# Altium project Bluethooth-V1.PrjPcb
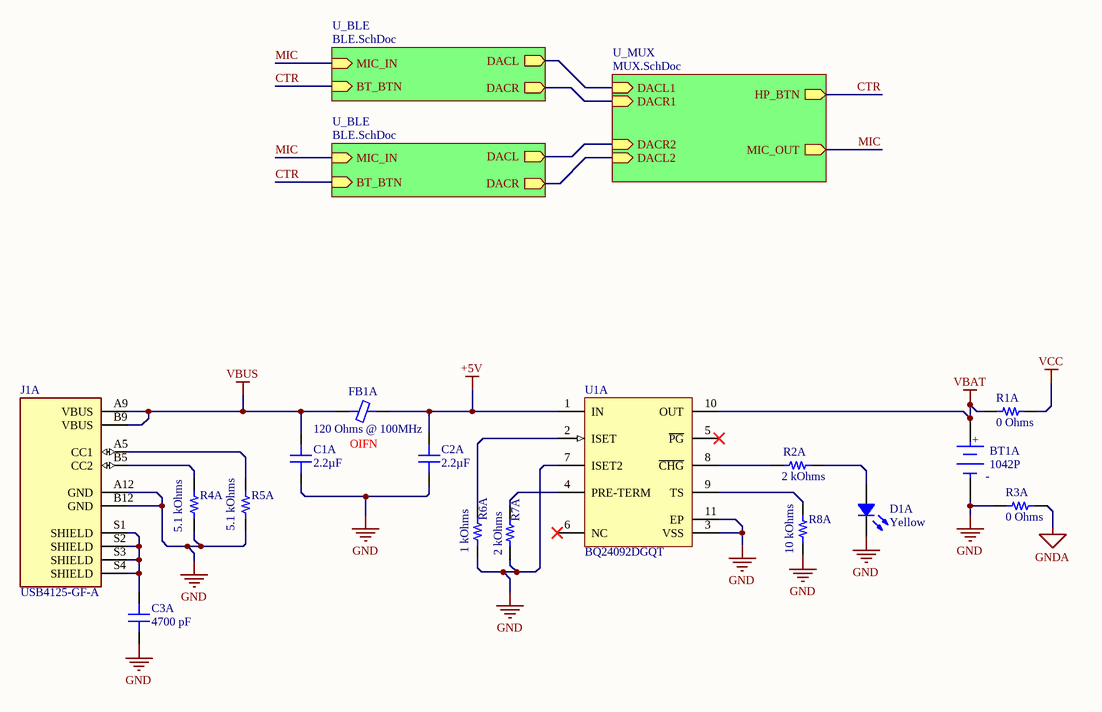
[diagram p0: Power.SchDoc]
CAGE_CODE: #; Date: 08.01.2023; DOC_NO_ASSY_DWG: #0112023010830; DOC_NO_BOM: #0112023010840; DOC_NO_FAB_DWG: #0112023010820; DOC_NO_SCH_DWG: #0112023010800; DocumentRevision: V2.0; PCB_DWG_NO: #0112023010810; Project: BLE-MUX; ProjectRevision: V1.1; Revision: V1.1
3 sheets, 58 parts. Net scope: hierarchical (ports join the sheet entries above them; power ports are global).
Board file: BLE.PcbDoc
Sheets:
  Power.SchDoc
    U_BLE = BLE.SchDoc
    U_MUX = MUX.SchDoc
    U_BLE = BLE.SchDoc

## Sheet Power.SchDoc: MAIN BLOCK & POWER
size A4; SheetNumber: 1; SheetTotal: 3

### Parts
BT1A  1042P  [FP-1042P-MFG]
C1A  2.2µF  [CAP 0402_1005]
C2A  2.2µF  [CAP 0402_1005]
C3A  4700 pF  [CAP 0402_1005]
D1A  Yellow  [LED 0402_1005 YELLOW]
FB1A  120 Ohms @ 100MHz  [FER 0201_0603]
J1A  USB4125-GF-A  [USB4125-GF-A]
R1A  0 Ohms  [RES 0603_1608]
R2A  2 kOhms  [RES 0402_1005]
R3A  0 Ohms  [RES 0603_1608]
R4A  5.1 kOhms  [RES 0402_1005]
R5A  5.1 kOhms  [RES 0402_1005]
R6A  1 kOhms  [RES 0402_1005]
R7A  2 kOhms  [RES 0402_1005]
R8A  10 kOhms  [RES 0402_1005]
U1A  BQ24092DGQT  [DGQ0010D_L]

### Sub-sheets
U_BLE = BLE.SchDoc: DACR (out), DACL (out), MIC_IN (in), BT_BTN (in)
U_BLE = BLE.SchDoc: DACR (out), DACL (out), MIC_IN (in), BT_BTN (in)
U_MUX = MUX.SchDoc: DACL1 (in), DACL2 (in), DACR1 (in), DACR2 (in), HP_BTN (out), MIC_OUT (out)

### Nets
+5V: C2A.2 FB1A.2 U1A.1(IN)
GND: BT1A.1(C) C1A.1 C2A.1 C3A.1 D1A.2 J1A.A12(GND) J1A.B12(GND) R3A.1 R4A.1 R5A.1 R6A.1 R7A.1 R8A.1 U1A.3(VSS) U1A.7(ISET2) U1A.11(EP)
GNDA: R3A.2
VBAT: BT1A.2(A) R1A.1 U1A.10(OUT)
VBUS: C1A.2 FB1A.1 J1A.A9(VBUS) J1A.B9(VBUS)
VCC: R1A.2
CTR: sheet U_BLE/BT_BTN, sheet U_MUX/HP_BTN, sheet U_BLE/BT_BTN  [project net BTN]
DACL: sheet U_BLE/DACL, sheet U_MUX/DACL1
DACL: sheet U_MUX/DACR2, sheet U_BLE/DACL  [a separate net that carries the same name]
DACR: sheet U_BLE/DACR, sheet U_MUX/DACR1
DACR: sheet U_MUX/DACL2, sheet U_BLE/DACR  [a separate net that carries the same name]
MIC: sheet U_BLE/MIC_IN, sheet U_MUX/MIC_OUT, sheet U_BLE/MIC_IN
NetC3A_2: C3A.2 J1A.S1(SHIELD) J1A.S2(SHIELD) J1A.S3(SHIELD) J1A.S4(SHIELD)
NetD1A_1: D1A.1 R2A.1
NetJ1A_A5: J1A.A5(CC1) R5A.2
NetJ1A_B5: J1A.B5(CC2) R4A.2
NetR2A_2: R2A.2 U1A.8(~{CHG})
NetR6A_2: R6A.2 U1A.2(ISET)
NetR7A_2: R7A.2 U1A.4(PRE-TERM)
NetR8A_2: R8A.2 U1A.9(TS)

Not connected (* = marked no-connect by the designer): U1A 5(~{PG})* 6(NC)*

### Notes on the sheet
- (near FB1A) OIFN
- THIS DOCUMENT AND THE DATA DISCLOSED HEREIN OR
- HEREWITH IS THE PROPERTY OF SPD Ind.
- ENG:
- DHARAGESWARAN S
- APPROVALS
- DATE
- PROJECT
- DSN:
- CHK:
- REFERENCE DOCUMENTS
- PROJECT REVISION:
- TITLE
- DOCUMENT REVISION:
- Email: sdhamuvkl@gmail.com <https://github.com/DhamuVkl>
- BOM:
- FAB DWG:
- PCB DWG:
- ASSY DWG:
- SCALE:
- A4
- SIZE
- CAGE CODE
- FILE NAME
- DWG NO.
- SHEET
- REV
- OF
- (in symbol CMP-19636-000019-1) +; -

### Library data of the parts
BT1A = CMP-19636-000019-1: BATTERY HOLDER 18650 SMD TAB; Number of Cells: 1; Max Operating Temperature: 145°C; Termination: SMD/SMT; Mount: Surface Mount; Min Operating Temperature: -50°C; Package Quantity: 200; Packaging: Tray; Lead Free: Lead Free
C1A C2A = 0402ZD225KAT2A: CAP CER 2.2UF 10V X5R 0402; Manufacturer: AVX Corporation; id: 2335; Tolerance: ±10%; Part Number: 0402ZD225KAT2A; Value: 2.2µF; Temperature Coefficient: X5R; Supplier Part Number 1: 478-10072-1-ND; ComponentLink2Description: DigiKey Link; ComponentLink1URL: http://datasheets.avx.com/cx5r.pdf; PartId: 9346; Supplier 1: DigiKey; Series: -; LastUpdated: 2022-02-08T12:26:45.707; Part Status: Active; Capacitance: 2.2µF; Device Package: 0402 (1005 Metric); Thickness (Max): 0.022" (0.56mm); Voltage - Rated: 10V; Minimum Order: 1; Packaging: TapeAndReel; Applications: General Purpose; Package / Case: 0402 (1005 Metric); ComponentLink1Description: Datasheet; Price: 0.09; ComponentLink2URL: http://digikey.com/product-detail/en/avx-corporation/0402ZD225KAT2A/478-10072-1-ND/6564294; Lifecycle Status: Active; Operating Temperature: -55°C ~ 85°C; Size / Dimension: 0.039" L x 0.020" W (1.00mm x 0.50mm); Mounting Type: Surface Mount, MLCC
C3A = C0402C472K4RECAUTO: CAP CER 0402 4.7NF 16V X7R 10%; Manufacturer: KEMET; id: 3032; Part Number: C0402C472K4RECAUTO; Value: 4700 pF; Temperature Coefficient: X7R; Supplier Part Number 1: 399-17875-1-ND; ComponentLink2Description: DigiKey Link; ComponentLink1URL: https://api.kemet.com/component-edge/download/datasheet/C0402C472K4RECAUTO.pdf; PartId: 12122; Tolerance: ±10%; Supplier 1: DigiKey; Series: ESD SMD Auto X7R; LastUpdated: 2023-01-03T20:03:46.940; Part Status: Active; Capacitance: 4700 pF; Device Package: 0402 (1005 Metric); Ratings: AEC-Q200; Thickness (Max): 0.022" (0.55mm); Voltage - Rated: 16V; Minimum Order: 1; Packaging: TapeAndReel; Applications: Automotive, ESD Protection; Package / Case: 0402 (1005 Metric); ComponentLink1Description: Datasheet; Price: 0.01; ComponentLink2URL: https://www.digikey.com/en/products/detail/kemet/C0402C472K4RECAUTO/8640469; Lifecycle Status: Active; Operating Temperature: -55°C ~ 125°C; Size / Dimension: 0.039" L x 0.020" W (1.00mm x 0.50mm); Mounting Type: Surface Mount, MLCC
D1A = XZMYK68W-2: LED YELLOW CLEAR CHIP SMD; Manufacturer: SunLED; id: 167; Lens Color: Colorless; Wavelength - Peak: 590nm; Lens Style: Rectangle with Flat Top; Viewing Angle: 120°; Lens Size: 0.80mm x 0.50mm; Configuration: Standard; Voltage - Forward (Vf) (Typ): 2V; Current - Test: 20mA; Millicandela Rating: 148mcd; Part Number: XZMYK68W-2; Supplier Part Number 1: 1497-1198-1-ND; Lens Transparency: Clear; Supplier Device Package: Chip LED; ComponentLink1Description: Datasheet; Color: Yellow; ComponentLink2URL: https://www.digikey.com/en/products/detail/sunled/XZMYK68W-2/4745801; ComponentLink1URL: https://www.sunledusa.com/products/spec/XZMYK68W-2.pdf; Supplier 1: DigiKey; Series: -; Height (Max): 0.60mm; Part Status: Active; ComponentLink2Description: DigiKey Link; Device Package: 0402 (1005 Metric); Packaging: TapeAndReel; Minimum Order: 1; Package / Case: 0402 (1005 Metric); PartId: 167; Wavelength - Dominant: 590nm; Lifecycle Status: Active; LastUpdated: 2023-01-02T20:57:30.307; Value: Yellow; Size / Dimension: 1.00mm L x 0.50mm W; Mounting Type: Surface Mount; Price: 0.05
FB1A = BKP0603HM121-T: FERRITE BEAD 120 OHM 0201 1LN; Manufacturer: Taiyo Yuden; id: 127; DC Resistance (DCR) (Max): 180mOhm; Number Of Lines: 1; Filter Type: Power Line; Current Rating (Max): 800mA; Part Number: BKP0603HM121-T; Supplier Part Number 1: 587-3283-1-ND; ComponentLink1Description: Datasheet; ComponentLink2URL: http://digikey.com/product-detail/en/taiyo-yuden/BKP0603HM121-T/587-3283-1-ND/4157927; ComponentLink1URL: https://ds.yuden.co.jp/TYCOMPAS/ut/detail?pn=BKP0603HM121-T  &u=M; Supplier 1: DigiKey; Series: BK; Height (Max): 0.013" (0.33mm); Part Status: Active; ComponentLink2Description: DigiKey Link; Device Package: 0201 (0603 Metric); Impedance @ Frequency: 120 Ohms @ 100MHz; Packaging: TapeAndReel; Minimum Order: 1; Package / Case: 0201 (0603 Metric); PartId: 127; Lifecycle Status: Active; LastUpdated: 2023-01-02T20:50:51.660; Operating Temperature: -55°C ~ 85°C; Value: 120 Ohms @ 100MHz; Size / Dimension: 0.024" L x 0.012" W (0.60mm x 0.30mm); Mounting Type: Surface Mount; Price: 0.03
J1A = USB4125-GF-A: CONN RCPT TYPE C 6P SMD RA; Manufacturer: GCT; MP: USB4125-GF-A_REVA2; id: 21; Mating Cycles: 20000; Current Rating (Amps): 3A; Connector Type: USB-C (USB TYPE-C); Number Of Contacts: 24 (6+18 Dummy); Voltage - Rated: 20VDC; Shielding: Shielded; Number Of Ports: 1; Gender: Receptacle; Package: None; Availability: Unavailable; Value: *; Price: 0.67; Part Number: USB4125-GF-A; Supplier Part Number 1: 2073-USB4125-GF-ACT-ND; Specifications: -; Termination: Solder; ComponentLink1Description: Datasheets; ComponentLink6URL: https://gct.co/files/info/gct_certificate_of_compliance.pdf; ComponentLink2URL: https://mm.digikey.com/Volume0/opasdata/d220001/medias/docus/5561/USB4125 - Product Spec.pdf; Features: Power Only, No Data; Solder Retention Tab; ComponentLink1URL: https://mm.digikey.com/Volume0/opasdata/d220001/medias/docus/5407/gct-usb-type-c-product-selection-guide-2023-v1.5_web.pdf; Mounting Feature: Horizontal; Supplier 1: DigiKey; Series: USB4125; ComponentLink6Description: Environmental Information; Part Status: Active; ComponentLink5URL: https://www.digikey.com/api/videos/videoplayer/smallplayer/6247993315001; Ingress Protection: -; ComponentLink2Description: Datasheets; Device Package: Cut Tape (CT); Packaging: Cut Tape (CT); ComponentLink5Description: Video File; Minimum Order: 1; Lifecycle Status: Active; LastUpdated: 2023-10-13T19:13:52.5975723; ComponentLink4URL: https://mm.digikey.com/Volume0/opasdata/d220001/medias/images/2644/MFG_USB4125-GF-A.jpg; Operating Temperature: -30°C ~ 85°C; ComponentLink4Description: Product Photos; Mounting Type: Surface Mount, Right Angle; Through Hole; ComponentLink3Description: Datasheets; ComponentLink3URL: https://mm.digikey.com/Volume0/opasdata/d220001/medias/docus/5561/USB4125 - Product Drawing.pdf
R1A R3A = RCC06030000Z0EA: RCC0603 0R0 ET1 E3; Manufacturer: Vishay Dale; id: 16538; Tolerance: Jumper; Power (Watts): 0.2W, 1/5W; Part Number: RCC06030000Z0EA; Height - Seated (Max): 0.020" (0.50mm); Supplier Part Number 1: 541-RCC06030000Z0EACT-ND; Supplier Device Package: 0603; ComponentLink1Description: Datasheet; ComponentLink2URL: https://www.digikey.com/en/products/detail/vishay-dale/RCC06030000Z0EA/12084250; Features: Automotive AEC-Q200; ComponentLink1URL: https://www.vishay.com/docs/20066/rcce3.pdf; Composition: Thick Film; Supplier 1: DigiKey; Series: RCC e3; Part Status: Active; ComponentLink2Description: DigiKey Link; Device Package: 0603 (1608 Metric); Packaging: TapeAndReel; Ratings: AEC-Q200; Minimum Order: 1; Package / Case: 0603 (1608 Metric); PartId: 67023; Lifecycle Status: Active; LastUpdated: 2023-01-02T20:27:57.037; Operating Temperature: -55°C ~ 155°C; Number Of Terminations: 2; Value: 0 Ohms; Size / Dimension: 0.061" L x 0.033" W (1.55mm x 0.85mm); Price: 0.01; Resistance: 0 Ohms
R2A R7A = AC0402FR-7W2KL: RES 2K OHM 1% 1/8W 0402; Manufacturer: Yageo; id: 15390; Temperature Coefficient: ±100ppm/°C; Power (Watts): 0.125W, 1/8W; Part Number: AC0402FR-7W2KL; Height - Seated (Max): 0.015" (0.37mm); Supplier Part Number 1: 13-AC0402FR-7W2KLCT-ND; Supplier Device Package: 0402; ComponentLink1Description: Datasheet; ComponentLink2URL: https://www.digikey.com/en/products/detail/yageo/AC0402FR-7W2KL/16990150; Features: Automotive AEC-Q200, Moisture Resistant; ComponentLink1URL: https://www.yageo.com/upload/media/product/productsearch/datasheet/rchip/PYu-AC_51_RoHS_L_10.pdf; Composition: Thick Film; Tolerance: ±1%; Supplier 1: DigiKey; Series: AC; ComponentLink2Description: DigiKey Link; Device Package: 0402 (1005 Metric); Packaging: CutTape; Ratings: AEC-Q200; Minimum Order: 1; Package / Case: 0402 (1005 Metric); PartId: 81829; Lifecycle Status: Active; LastUpdated: 2023-10-29T19:24:41.980; Operating Temperature: -55°C ~ 155°C; Number Of Terminations: 2; Value: 2 kOhms; Size / Dimension: 0.039" L x 0.020" W (1.00mm x 0.50mm); Price: 0.01; Resistance: 2 kOhms
R4A R5A = AC0402FR-075K1L: RES SMD 5.1K OHM 1% 1/16W 0402; Manufacturer: Yageo; id: 5028; Temperature Coefficient: ±100ppm/°C; Power (Watts): 0.063W, 1/16W; Part Number: AC0402FR-075K1L; Height - Seated (Max): 0.015" (0.37mm); Supplier Part Number 1: YAG3503CT-ND; Supplier Device Package: 0402; ComponentLink1Description: Datasheet; ComponentLink2URL: https://www.digikey.com/en/products/detail/yageo/AC0402FR-075K1L/5895438; Features: Automotive AEC-Q200, Moisture Resistant; ComponentLink1URL: https://www.yageo.com/upload/media/product/productsearch/datasheet/rchip/PYu-AC_51_RoHS_L_7.pdf; Composition: Thick Film; Tolerance: ±1%; Supplier 1: DigiKey; Series: AC; Part Status: Active; ComponentLink2Description: DigiKey Link; Device Package: 0402 (1005 Metric); Packaging: CutTape; Ratings: AEC-Q200; Minimum Order: 1; Package / Case: 0402 (1005 Metric); PartId: 12111; Lifecycle Status: Active; LastUpdated: 2023-01-02T20:21:09.567; Operating Temperature: -55°C ~ 155°C; Number Of Terminations: 2; Value: 5.1 kOhms; Size / Dimension: 0.039" L x 0.020" W (1.00mm x 0.50mm); Price: 0.01; Resistance: 5.1 kOhms
R6A = AC0402FR-071KL: RES SMD 1K OHM 1% 1/16W 0402; Manufacturer: Yageo; id: 4988; Temperature Coefficient: ±100ppm/°C; Power (Watts): 0.063W, 1/16W; Part Number: AC0402FR-071KL; Height - Seated (Max): 0.015" (0.37mm); Supplier Part Number 1: 311-1KLBCT-ND; Supplier Device Package: 0402; ComponentLink1Description: Datasheet; ComponentLink2URL: https://www.digikey.com/en/products/detail/yageo/AC0402FR-071KL/2827801; Features: Automotive AEC-Q200, Moisture Resistant; ComponentLink1URL: https://www.yageo.com/upload/media/product/productsearch/datasheet/rchip/PYu-AC_51_RoHS_L_7.pdf; Composition: Thick Film; Tolerance: ±1%; Supplier 1: DigiKey; Series: AC; Part Status: Active; ComponentLink2Description: DigiKey Link; Device Package: 0402 (1005 Metric); Packaging: CutTape; Ratings: AEC-Q200; Minimum Order: 1; Package / Case: 0402 (1005 Metric); PartId: 12037; Lifecycle Status: Active; LastUpdated: 2023-01-02T20:21:09.907; Operating Temperature: -55°C ~ 155°C; Number Of Terminations: 2; Value: 1 kOhms; Size / Dimension: 0.039" L x 0.020" W (1.00mm x 0.50mm); Price: 0.01; Resistance: 1 kOhms
R8A = AC0402FR-0710KL: RES SMD 10K OHM 1% 1/16W 0402; Manufacturer: Yageo; id: 4984; Temperature Coefficient: ±100ppm/°C; Power (Watts): 0.063W, 1/16W; Part Number: AC0402FR-0710KL; Height - Seated (Max): 0.015" (0.37mm); Supplier Part Number 1: YAG3436CT-ND; Supplier Device Package: 0402; ComponentLink1Description: Datasheet; ComponentLink2URL: https://www.digikey.com/en/products/detail/yageo/AC0402FR-0710KL/5895030; Features: Automotive AEC-Q200, Moisture Resistant; ComponentLink1URL: https://www.yageo.com/upload/media/product/productsearch/datasheet/rchip/PYu-AC_51_RoHS_L_7.pdf; Composition: Thick Film; Tolerance: ±1%; Supplier 1: DigiKey; Series: AC; Part Status: Active; ComponentLink2Description: DigiKey Link; Device Package: 0402 (1005 Metric); Packaging: CutTape; Ratings: AEC-Q200; Minimum Order: 1; Package / Case: 0402 (1005 Metric); PartId: 12029; Lifecycle Status: Active; LastUpdated: 2023-01-02T20:21:09.957; Operating Temperature: -55°C ~ 155°C; Number Of Terminations: 2; Value: 10 kOhms; Size / Dimension: 0.039" L x 0.020" W (1.00mm x 0.50mm); Price: 0.01; Resistance: 10 kOhms
U1A = CMP-0321-00905-2: 1 A, Single-Input, Single-Cell Li-Ion Battery Charger with Operation Over JEITA and 10 k ohm NTC, 4.5 V, -40 to 150 degC, 10-pin MSOP-PowerPAD (DGQ), Green (RoHS & no Sb/Br); Manufacturer: Texas Instruments; Over Voltage Protection: N; SubFamily: Battery Charge Management; Vin(Min)(V): 4.5; Eco-Plan: Green (RoHS & no Sb/Br); DatasheetVersion: SLUS968C; ComponentLink1URL: http://www.ti.com/general/docs/lit/getliterature.tsp?genericPartNumber=BQ24092&fileType=pdf; NiMH: N; Lead Acid: N; Li-Ion: N; Mounting Technology: Surface Mount; NiCd: N; PackageVersion: revF, Nov-2011; Code_JEDEC: MO-187-BA-T; ComponentLink1Description: Datasheet; PartNumber: BQ24092DGQT; Li-Polymer: N; PackageDescription: 10-Pin PowerPAD Plastic Small Outline 0.5 mm Pitch, Exposed Pad; PackageReference: DGQ0010D

## Sheet BLE.SchDoc: BLE AC6925A
size A4; SheetNumber: 2; SheetTotal: 3; DOC_NO_SCH_DWG: #0112023010801
Used 2 times, as channels U_BLE, U_BLE. Parts and nets are listed once, with the designators drawn on the sheet.
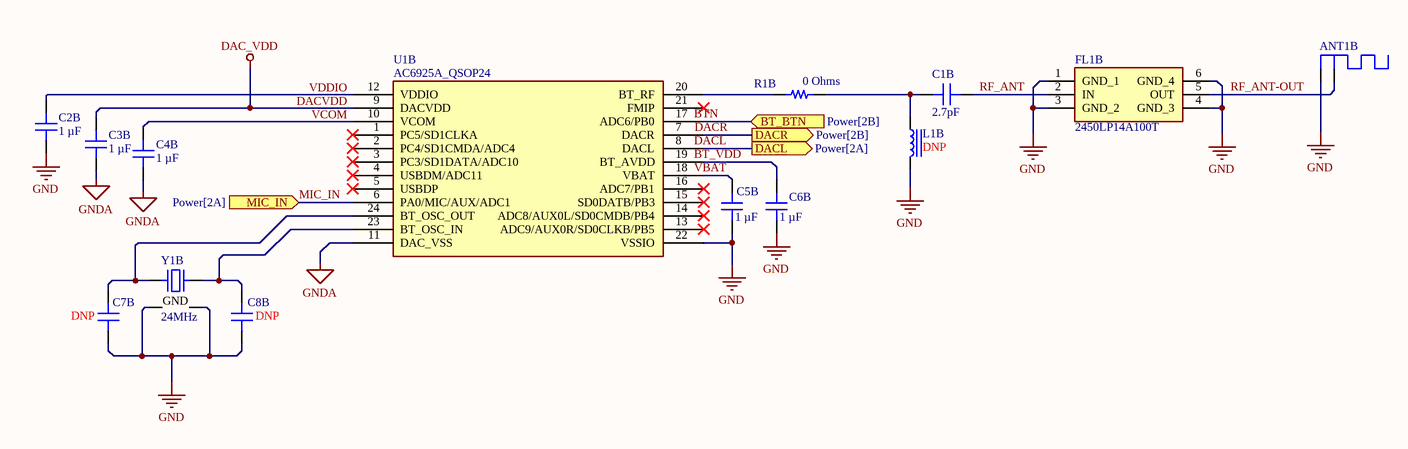
[diagram p1: BLE.SchDoc]

### Parts
ANT1B  ANTENNA  [RN-ANT]  (value not drawn)
C1B  2.7pF  [CAP 0402_1005]
C2B  1 µF  [CAP 0603_1608]
C3B  1 µF  [CAP 0603_1608]
C4B  1 µF  [CAP 0603_1608]
C5B  1 µF  [CAP 0603_1608]
C6B  1 µF  [CAP 0603_1608]
C7B  DNP  [CAP 0402_1005]
C8B  DNP  [CAP 0402_1005]
FL1B  2450LP14A100T  [2450LP14A100T]
L1B  DNP  [IND 0402_1005 RF WW]
R1B  0 Ohms  [RES 0402_1005]
U1B  AC6925A  [AC6925A]  (value not drawn)
Y1B  24MHz  [ABRACON ABM10]

### Ports
BT_BTN (in, see Power[2B]), DACL (out, see Power[2A]), DACR (out, see Power[2B]), MIC_IN (in, see Power[2A])

### Nets
DAC_VDD: C3B.2 U1B.9(DACVDD)
GND: ANT1B.GND C2B.1 C5B.1 C6B.1 C7B.1 C8B.1 FL1B.1(GND_1) FL1B.3(GND_2) FL1B.4(GND_3) FL1B.6(GND_4) L1B.2 U1B.22(VSSIO) Y1B.2(GND) Y1B.4(GND)
GNDA: C3B.1 C4B.1 U1B.11(DAC_VSS)
BT_VDD: C6B.2 U1B.19(BT_AVDD)
BTN: U1B.17(ADC6/PB0) ; port BT_BTN
DACL: U1B.8(DACL) ; port DACL
DACR: U1B.7(DACR) ; port DACR
MIC_IN: U1B.6(PA0/MIC/AUX/ADC1) ; port MIC_IN
RF_ANT: C1B.2 FL1B.2(IN)
RF_ANT-OUT: ANT1B.FEED FL1B.5(OUT)
VBAT: C5B.2 U1B.18(VBAT)
NetC1B_1: C1B.1 L1B.1 R1B.2
NetC2B_2: C2B.2 U1B.12(VDDIO)
NetC4B_2: C4B.2 U1B.10(VCOM)
NetC7B_2: C7B.2 U1B.24(BT_OSC_OUT) Y1B.1
NetC8B_2: C8B.2 U1B.23(BT_OSC_IN) Y1B.3
NetR1B_1: R1B.1 U1B.20(BT_RF)

Not connected (* = marked no-connect by the designer): U1B 1(PC5/SD1CLKA)* 2(PC4/SD1CMDA/ADC4)* 3(PC3/SD1DATA/ADC10)* 4(USBDM/ADC11)* 5(USBDP)* 13(ADC9/AUX0R/SD0CLKB/PB5)* 14(ADC8/AUX0L/SD0CMDB/PB4)* 15(SD0DATB/PB3)* 16(ADC7/PB1)* 21(FMIP)*

### Channels
U_BLE: designators end in _U_BLE#1; ports BT_BTN=BTN DACL=DACL DACR=DACR MIC_IN=MIC
U_BLE: designators end in _U_BLE#2; ports BT_BTN=BTN DACL=DACL DACR=DACR MIC_IN=MIC

### Notes on the sheet
- Labels drawn without touching a wire or pin: DACVDD, VCOM, VDDIO
- THIS DOCUMENT AND THE DATA DISCLOSED HEREIN OR
- HEREWITH IS THE PROPERTY OF SPD Ind.
- ENG:
- DHARAGESWARAN S
- APPROVALS
- DATE
- PROJECT
- DSN:
- CHK:
- REFERENCE DOCUMENTS
- PROJECT REVISION:
- TITLE
- DOCUMENT REVISION:
- Email: sdhamuvkl@gmail.com <https://github.com/DhamuVkl>
- BOM:
- FAB DWG:
- PCB DWG:
- ASSY DWG:
- SCALE:
- A4
- SIZE
- CAGE CODE
- FILE NAME
- DWG NO.
- SHEET
- REV
- OF
- (in symbol AC6925A) AC6925A_QSOP24

### Library data of the parts
ANT1B = ANTENNA: 1.575GHz, 2.45GHz Bluetooth, GPS, Wi-Fi Chip RF Antenna 2.4GHz ~ 2.5GHz 0.28dBi, -2.17dBi, -0.82dBi, 0.24dBi Solder Surface Mount; MF: Infineon Technologies; Package: SMD-2 Infineon Technologies; MP: Antenna; Value: *; Availability: Unavailable; Price: None; SnapEDA_Link: https://www.snapeda.com/parts/Antenna/Infineon%20Technologies/view-part/3603982/?ref=snap
C1B = 04023A2R7BAT2A: CAP CER 2.7PF 25V NP0 0402; Manufacturer: AVX Corporation; id: 1723; Temperature Coefficient: C0G, NP0; Tolerance: ±0.1pF; Part Number: 04023A2R7BAT2A; Value: 2.7pF; Supplier Part Number 1: 478-12612-1-ND; ComponentLink2Description: DigiKey Link; ComponentLink1URL: http://datasheets.avx.com/C0GNP0-Dielectric.pdf; PartId: 7013; Supplier 1: DigiKey; Series: -; LastUpdated: 2022-02-08T12:26:50.017; Part Status: Active; Capacitance: 2.7pF; Device Package: 0402 (1005 Metric); Thickness (Max): 0.022" (0.56mm); Voltage - Rated: 25V; Minimum Order: 1; Packaging: TapeAndReel; Applications: General Purpose; Package / Case: 0402 (1005 Metric); ComponentLink1Description: Datasheet; Price: 0.06; ComponentLink2URL: http://digikey.com/product-detail/en/avx-corporation/04023A2R7BAT2A/478-12612-1-ND/9949150; Lifecycle Status: Active; Operating Temperature: -55°C ~ 125°C; Size / Dimension: 0.039" L x 0.020" W (1.00mm x 0.50mm); Mounting Type: Surface Mount, MLCC
C2B C3B C4B C5B C6B = CC0603ZRY5V6BB105: CAP CER 1UF 10V Y5V 0603; Manufacturer: Yageo; id: 740; Temperature Coefficient: Y5V (F); Tolerance: -20%, +80%; Part Number: CC0603ZRY5V6BB105; Value: 1 µF; Supplier Part Number 1: 311-1357-1-ND; ComponentLink2Description: DigiKey Link; ComponentLink1URL: http://www.yageo.com/documents/recent/UPY-GPHC_Y5V_6.3V-to-50V_8.pdf; PartId: 5197; Supplier 1: DigiKey; Series: CC; LastUpdated: 2023-01-03T20:07:40.253; Part Status: Active; Capacitance: 1 µF; Device Package: 0603 (1608 Metric); Thickness (Max): 0.035" (0.90mm); Voltage - Rated: 10V; Minimum Order: 1; Packaging: TapeAndReel; Applications: General Purpose; Package / Case: 0603 (1608 Metric); ComponentLink1Description: Datasheet; Price: 0.01; ComponentLink2URL: https://www.digikey.com/en/products/detail/yageo/CC0603ZRY5V6BB105/2103095; Lifecycle Status: Active; Operating Temperature: -30°C ~ 85°C; Size / Dimension: 0.063" L x 0.031" W (1.60mm x 0.80mm); Mounting Type: Surface Mount, MLCC
C7B C8B = 885012005007: CAP CER 10PF 10V C0G/NP0 0402; Manufacturer: Würth Elektronik; id: 1924; Temperature Coefficient: C0G, NP0; Tolerance: ±5%; Part Number: 885012005007; Value: 10 pF; Supplier Part Number 1: 732-7425-1-ND; ComponentLink2Description: DigiKey Link; ComponentLink1URL: https://katalog.we-online.de/pbs/datasheet/885012005007.pdf; PartId: 7736; Supplier 1: DigiKey; Series: WCAP-CSGP; LastUpdated: 2023-01-03T20:04:00.900; Part Status: Active; Capacitance: 10 pF; Device Package: 0402 (1005 Metric); Thickness (Max): 0.022" (0.55mm); Voltage - Rated: 10V; Minimum Order: 1; Packaging: TapeAndReel; Applications: General Purpose; Package / Case: 0402 (1005 Metric); ComponentLink1Description: Datasheet; Price: 0.01; ComponentLink2URL: https://www.digikey.com/en/products/detail/würth-elektronik/885012005007/5453280; Lifecycle Status: Active; Operating Temperature: -55°C ~ 125°C; Size / Dimension: 0.039" L x 0.020" W (1.00mm x 0.50mm); Mounting Type: Surface Mount, MLCC
FL1B = 2450LP14A100T: Filter; Manufacturer_Name: JOHANSON TECHNOLOGY; Datasheet Link: https://componentsearchengine.com/Datasheets/1/2450LP14A100T.pdf; Height: 0.7mm; Manufacturer_Part_Number: 2450LP14A100T; Mouser Part Number: 609-2450LP14A100T; Mouser Price/Stock: https://www.mouser.co.uk/ProductDetail/Johanson-Technology/2450LP14A100T?qs=yCnrNFeXz%252BgP94nTCDCKIA%3D%3D; Arrow Part Number: 2450LP14A100T; Arrow Price/Stock: https://www.arrow.com/en/products/2450lp14a100t/johanson-dielectrics?region=nac; Supplier 1: Mouser; Supplier Part Number 1: 609-2450LP14A100T
L1B = 744765010A: FIXED IND 1NH 1.36A 45 MOHM SMD; Manufacturer: Würth Elektronik; id: 685; Frequency - Self Resonant: 6GHz; Tolerance: ±0.2nH; Type: Drum Core, Wirewound; Inductance Frequency - Test: 250 MHz; Q @ Freq: 13 @ 250MHz; Material - Core: Ceramic; DC Resistance (DCR): 45mOhm Max; Shielding: Unshielded; Part Number: 744765010A; Height - Seated (Max): 0.024" (0.60mm); Supplier Part Number 1: 732-1703-1-ND; Current Rating (Amps): 1.36 A; Supplier Device Package: 0402 (1005 Metric); Inductance: 1 nH; ComponentLink1Description: Datasheet; ComponentLink2URL: https://www.digikey.com/en/products/detail/würth-elektronik/744765010A/1994068; ComponentLink1URL: https://katalog.we-online.de/pbs/datasheet/744765010A.pdf; Supplier 1: DigiKey; Series: WE-KI; Part Status: Active; ComponentLink2Description: DigiKey Link; Device Package: 0402 (1005 Metric); Packaging: TapeAndReel; Minimum Order: 1; Package / Case: 0402 (1005 Metric); PartId: 685; Lifecycle Status: Active; LastUpdated: 2023-01-02T20:59:39.830; Operating Temperature: -40°C ~ 125°C; Value: 1 nH; Size / Dimension: 0.039" L x 0.022" W (1.00mm x 0.55mm); Mounting Type: Surface Mount; Price: 0.27
R1B = AC0402JR-070RL: RES SMD 0 OHM JUMPER 1/16W 0402; Manufacturer: Yageo; id: 9339; Power (Watts): 0.063W, 1/16W; Part Number: AC0402JR-070RL; Height - Seated (Max): 0.015" (0.37mm); Supplier Part Number 1: 311-0.0LBCT-ND; Supplier Device Package: 0402; ComponentLink1Description: Datasheet; ComponentLink2URL: https://www.digikey.com/en/products/detail/yageo/AC0402JR-070RL/2827807; Features: Automotive AEC-Q200, Moisture Resistant; ComponentLink1URL: https://www.yageo.com/upload/media/product/productsearch/datasheet/rchip/PYu-AC_51_RoHS_L_7.pdf; Composition: Thick Film; Tolerance: Jumper; Supplier 1: DigiKey; Series: AC; Part Status: Active; ComponentLink2Description: DigiKey Link; Device Package: 0402 (1005 Metric); Packaging: CutTape; Ratings: AEC-Q200; Minimum Order: 1; Package / Case: 0402 (1005 Metric); PartId: 20617; Lifecycle Status: Active; LastUpdated: 2023-01-02T20:20:32.243; Operating Temperature: -55°C ~ 155°C; Number Of Terminations: 2; Value: 0 Ohms; Size / Dimension: 0.039" L x 0.020" W (1.00mm x 0.50mm); Price: 0.01; Resistance: 0 Ohms
U1B = AC6925A: Bluetooth Audio IC; MF: Analog Devices; MP: MAX1092BCEG+; Value: *; Package: QSOP-24 Maxim; Check_prices: https://www.snapeda.com/parts/MAX1092BCEG+/Analog+Devices/view-part/?ref=eda; Price: None; Availability: In Stock; SnapEDA_Link: https://www.snapeda.com/parts/MAX1092BCEG+/Analog+Devices/view-part/?ref=snap
Y1B = ABM10-24.000MHZ-E20-T: CRYSTAL 24.0000MHZ 10PF SMD; Manufacturer: Abracon LLC; id: 280; Frequency Tolerance: ±20ppm; Operating Mode: Fundamental; Esr (Equivalent Series Resistance): 100 Ohms; Part Number: ABM10-24.000MHZ-E20-T; Height - Seated (Max): 0.028" (0.70mm); Supplier Part Number 1: 535-9093-1-ND; ComponentLink1Description: Datasheet; ComponentLink2URL: http://digikey.com/product-detail/en/abracon-llc/ABM10-24.000MHZ-E20-T/535-9093-1-ND/675610; ComponentLink1URL: https://abracon.com/Resonators/ABM10.pdf; Supplier 1: DigiKey; Frequency: 24MHz; Series: ABM10; Part Status: Active; Type: MHz Crystal; ComponentLink2Description: DigiKey Link; Device Package: 4-SMD, No Lead; Packaging: TapeAndReel; Frequency Stability: ±20ppm; Minimum Order: 1; Package / Case: 4-SMD, No Lead; PartId: 280; Lifecycle Status: Active; LastUpdated: 2020-03-19T22:27:45.907; Operating Temperature: -20°C ~ 70°C; Value: 24MHz; Size / Dimension: 0.098" L x 0.079" W (2.50mm x 2.00mm); Mounting Type: Surface Mount; Price: 0.96; Load Capacitance: 10pF

## Sheet MUX.SchDoc: AUDIO-MUX
size A4; SheetNumber: 3; SheetTotal: 3; DOC_NO_SCH_DWG: #0112023010802
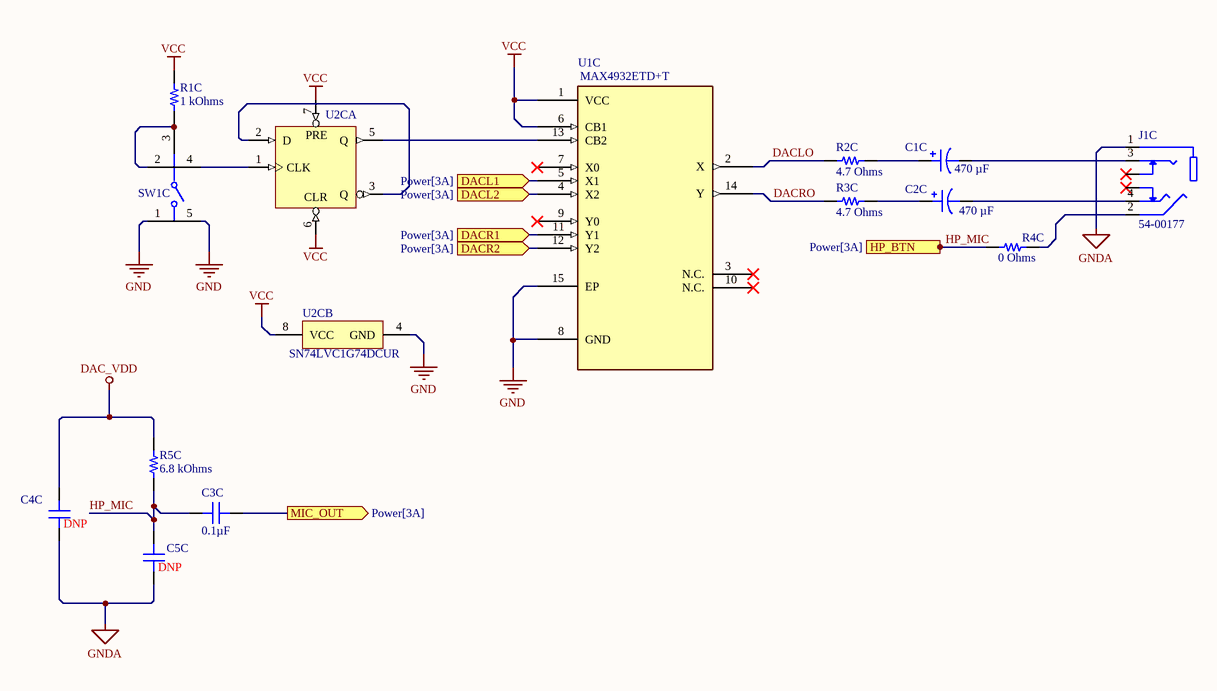
[diagram p2: MUX.SchDoc]

### Parts
C1C  470 µF  [CAP ALSMD POLY 8.3MM H10.0MM]
C2C  470 µF  [CAP ALSMD POLY 8.3MM H10.0MM]
C3C  0.1µF  [CAP 0603_1608]
C4C  DNP  [CAP 0603_1608]
C5C  DNP  [CAP 0603_1608]
J1C  54-00177  [TENSILITY_54-00177]
R1C  1 kOhms  [RES 0603_1608]
R2C  4.7 Ohms  [RES 0603_1608]
R3C  4.7 Ohms  [RES 0603_1608]
R4C  0 Ohms  [RES 0402_1005]
R5C  6.8 kOhms  [RES 0603_1608]
SW1C  KMS231GPLFS  [FP-KMS231GPLFS-MFG]  (value not drawn)
U1C  MAX4932ETD+T  [21-0137_T1433+2_MXM]  (value not drawn)
U2C  SN74LVC1G74DCUR  [DCU0008A_L]  (value not drawn)  (parts A,B of 2)

### Ports
DACL1 (in, see Power[3A]), DACL2 (in, see Power[3A]), DACR1 (in, see Power[3A]), DACR2 (in, see Power[3A]), HP_BTN (out, see Power[3A]), MIC_OUT (out, see Power[3A])

### Nets
DAC_VDD: C4C.1 R5C.2
GND: SW1C.1 SW1C.5 U1C.8(GND) U1C.15(EP) U2C.4(GND)
GNDA: C4C.2 C5C.2 J1C.1
VCC: R1C.2 U1C.1(VCC) U1C.6(CB1) U2C.6(~{CLR}) U2C.7(~{PRE}) U2C.8(VCC)
DACL: U1C.5(X1) ; port DACL1
DACL: U1C.12(Y2) ; port DACR2  [a separate net that carries the same name]
DACLO: R2C.1 U1C.2(X)
DACR: U1C.11(Y1) ; port DACR1
DACR: U1C.4(X2) ; port DACL2  [a separate net that carries the same name]
DACRO: R3C.1 U1C.14(Y)
HP_MIC: C3C.2 C5C.1 R4C.1 R5C.1 ; port HP_BTN  [project net BTN]
MIC: C3C.1 ; port MIC_OUT
NetC1C_1: C1C.1 R2C.2
NetC1C_2: C1C.2 J1C.3
NetC2C_1: C2C.1 R3C.2
NetC2C_2: C2C.2 J1C.4
NetJ1C_2: J1C.2 R4C.2
NetR1C_1: R1C.1 SW1C.2 SW1C.3
NetSW1C_4: SW1C.4 U2C.1(CLK)
NetU1C_13: U1C.13(CB2) U2C.5(Q)
NetU2C_2: U2C.2(D) U2C.3(Q)

Not connected (* = marked no-connect by the designer): J1C 5* 6*; U1C 3(N.C.)* 7(X0)* 9(Y0)* 10(N.C.)*

### Notes on the sheet
- THIS DOCUMENT AND THE DATA DISCLOSED HEREIN OR
- HEREWITH IS THE PROPERTY OF SPD Ind.
- ENG:
- DHARAGESWARAN S
- APPROVALS
- DATE
- PROJECT
- DSN:
- CHK:
- REFERENCE DOCUMENTS
- PROJECT REVISION:
- TITLE
- DOCUMENT REVISION:
- Email: sdhamuvkl@gmail.com <https://github.com/DhamuVkl>
- BOM:
- FAB DWG:
- PCB DWG:
- ASSY DWG:
- SCALE:
- A4
- SIZE
- CAGE CODE
- FILE NAME
- DWG NO.
- SHEET
- REV
- OF
- (in symbol CMP-0859-00701-3, part A) PRE; CLR

### Library data of the parts
C1C C2C = SVZ1AM471F9RE00RAXXX: POLYMER ALUMINUM SMT; Manufacturer: Aishi Capacitors (Hunan Aihua Group; id: 968; Surface Mount Land Size: 0.327" L x 0.327" W (8.30mm x 8.30mm); Tolerance: ±20%; Voltage - Rated: 10 V; Lifetime @ Temp.: 2000 Hrs @ 105°C; Ripple Current @ High Frequency: 3.4 A @ 100 kHz; Esr (Equivalent Series Resistance): 22mOhm; Part Number: SVZ1AM471F9RE00RAXXX; Value: 470 µF; Height - Seated (Max): 0.394" (10.00mm); Supplier Part Number 1: 3222-SVZ1AM471F9RE00RAXXXCT-ND; ComponentLink2Description: DigiKey Link; PartId: 5392; Supplier 1: DigiKey; Series: VZ; LastUpdated: 2023-01-02T21:05:51.287; Part Status: Active; Type: Polymer; Capacitance: 470 µF; Minimum Order: 1; Packaging: TapeAndReel; Applications: General Purpose; Price: 0.22; ComponentLink2URL: https://www.digikey.com/en/products/detail/aishi-capacitors/SVZ1AM471F9RE00RAXXX/16536381; Lifecycle Status: Active; Operating Temperature: -55°C ~ 105°C; Size / Dimension: 0.315" Dia (8.00mm); Mounting Type: Surface Mount
C3C = LD03ZC104KAB2A: CAP CER 0.1UF 10V X7R 0603; Manufacturer: AVX Corporation; id: 3762; Tolerance: ±10%; Part Number: LD03ZC104KAB2A; Value: 0.1µF; Temperature Coefficient: X7R; Supplier Part Number 1: 478-12926-1-ND; ComponentLink2Description: DigiKey Link; ComponentLink1URL: http://datasheets.avx.com/LD-Series.pdf; PartId: 16481; Supplier 1: DigiKey; Series: LD; LastUpdated: 2020-09-02T01:03:06.140; Part Status: Active; Capacitance: 0.1µF; Device Package: 0603 (1608 Metric); Thickness (Max): 0.035" (0.90mm); Voltage - Rated: 10V; Minimum Order: 1; Packaging: TapeAndReel; Applications: General Purpose; Package / Case: 0603 (1608 Metric); ComponentLink1Description: Datasheet; Price: 0.17; ComponentLink2URL: http://digikey.com/product-detail/en/avx-corporation/LD03ZC104KAB2A/478-12926-1-ND/9949296; Lifecycle Status: Active; Operating Temperature: -55°C ~ 125°C; Size / Dimension: 0.063" L x 0.032" W (1.60mm x 0.81mm); Mounting Type: Surface Mount, MLCC
C4C C5C = LD03ZC104KAB2A: CAP CER 0.1UF 10V X7R 0603; Manufacturer: AVX Corporation; id: 3762; Value: 0.1µF; Tolerance: ±10%; Part Number: LD03ZC104KAB2A; Temperature Coefficient: X7R; Supplier Part Number 1: 478-12926-1-ND; ComponentLink2Description: DigiKey Link; ComponentLink1URL: http://datasheets.avx.com/LD-Series.pdf; PartId: 16481; Supplier 1: DigiKey; Series: LD; LastUpdated: 2020-09-02T01:03:06.140; Part Status: Active; Capacitance: 0.1µF; Device Package: 0603 (1608 Metric); Thickness (Max): 0.035" (0.90mm); Voltage - Rated: 10V; Minimum Order: 1; Packaging: TapeAndReel; Applications: General Purpose; Package / Case: 0603 (1608 Metric); ComponentLink1Description: Datasheet; Price: 0.17; ComponentLink2URL: http://digikey.com/product-detail/en/avx-corporation/LD03ZC104KAB2A/478-12926-1-ND/9949296; Lifecycle Status: Active; Operating Temperature: -55°C ~ 125°C; Size / Dimension: 0.063" L x 0.032" W (1.60mm x 0.81mm); Mounting Type: Surface Mount, MLCC
J1C = 54-00177: Connector, 4C audio jack, 3.5xL14 mm, SMT mount, gold plated; MF: Tensility International Corp; Package: None; Price: None; Check_prices: https://www.snapeda.com/parts/54-00177/Tensility+International+Corp/view-part/?ref=eda; Value: *; SnapEDA_Link: https://www.snapeda.com/parts/54-00177/Tensility+International+Corp/view-part/?ref=snap; MP: 54-00177; Availability: In Stock; Purchase-URL: https://pricing.snapeda.com/search?q=54-00177&ref=eda
R1C = RT0603FRE131KL: CHIP RESISTOR THIN FLIM HIGH PRE; Manufacturer: Yageo; id: 16662; Temperature Coefficient: ±50ppm/°C; Tolerance: ±1%; Power (Watts): 0.1W, 1/10W; Part Number: RT0603FRE131KL; Height - Seated (Max): 0.022" (0.55mm); Supplier Part Number 1: 13-RT0603FRE131KLCT-ND; Supplier Device Package: 0603; ComponentLink1Description: Datasheet; ComponentLink2URL: https://www.digikey.com/en/products/detail/yageo/RT0603FRE131KL/14008371; ComponentLink1URL: https://www.yageo.com/upload/media/product/productsearch/datasheet/rchip/PYu-RT_1-to-0.01_RoHS_L_12.pdf; Composition: Thin Film; Supplier 1: DigiKey; Series: RT; Part Status: Active; ComponentLink2Description: DigiKey Link; Device Package: 0603 (1608 Metric); Packaging: TapeAndReel; Minimum Order: 1; Package / Case: 0603 (1608 Metric); PartId: 67562; Lifecycle Status: Active; LastUpdated: 2023-01-02T20:27:55.493; Operating Temperature: -55°C ~ 155°C; Number Of Terminations: 2; Value: 1 kOhms; Size / Dimension: 0.063" L x 0.031" W (1.60mm x 0.80mm); Price: 0.01; Resistance: 1 kOhms
R2C R3C = SG73P1JTTD4R70F: RES 4.7 OHM 1% 1/3W 0603; Manufacturer: KOA Speer Electronics, Inc.; id: 16524; Temperature Coefficient: ±100ppm/°C; Power (Watts): 0.333W, 1/3W; Part Number: SG73P1JTTD4R70F; Height - Seated (Max): 0.022" (0.55mm); Supplier Part Number 1: 2019-SG73P1JTTD4R70FCT-ND; Supplier Device Package: 0603; ComponentLink1Description: Datasheet; ComponentLink2URL: https://www.digikey.com/en/products/detail/koa-speer-electronics-inc/SG73P1JTTD4R70F/10188387; Features: Automotive AEC-Q200, Pulse Withstanding; ComponentLink1URL: https://www.koaspeer.com/pdfs/SG73P.pdf; Composition: Thick Film; Tolerance: ±1%; Supplier 1: DigiKey; Series: SG73P; Part Status: Active; ComponentLink2Description: DigiKey Link; Device Package: 0603 (1608 Metric); Packaging: TapeAndReel; Ratings: AEC-Q200; Minimum Order: 1; Package / Case: 0603 (1608 Metric); PartId: 66982; Lifecycle Status: Active; LastUpdated: 2023-01-02T20:27:57.163; Operating Temperature: -55°C ~ 155°C; Number Of Terminations: 2; Value: 4.7 Ohms; Size / Dimension: 0.063" L x 0.031" W (1.60mm x 0.80mm); Price: 0.01; Resistance: 4.7 Ohms
R4C = AC0402JR-070RL: as R1B on sheet BLE; Part Number: AC0402JR-070RL; Height - Seated (Max): 0.015" (0.37mm); Supplier Part Number 1: 311-0.0LBCT-ND; Supplier Device Package: 0402; ComponentLink1Description: Datasheet; ComponentLink2URL: https://www.digikey.com/en/products/detail/yageo/AC0402JR-070RL/2827807; Features: Automotive AEC-Q200, Moisture Resistant; ComponentLink1URL: https://www.yageo.com/upload/media/product/productsearch/datasheet/rchip/PYu-AC_51_RoHS_L_7.pdf; Composition: Thick Film; Tolerance: Jumper; Supplier 1: DigiKey; Series: AC; Part Status: Active; ComponentLink2Description: DigiKey Link; Device Package: 0402 (1005 Metric); Packaging: CutTape; Ratings: AEC-Q200; Minimum Order: 1; Package / Case: 0402 (1005 Metric); PartId: 20617; Lifecycle Status: Active; LastUpdated: 2023-01-02T20:20:32.243; Operating Temperature: -55°C ~ 155°C; Number Of Terminations: 2; Value: 0 Ohms; Size / Dimension: 0.039" L x 0.020" W (1.00mm x 0.50mm); Price: 0.01; Resistance: 0 Ohms
R5C = ERA-3AEB682V: RES SMD 6.8K OHM 0.1% 1/10W 0603; Manufacturer: Panasonic Electronic Components; id: 311; Temperature Coefficient: ±25ppm/°C; Power (Watts): 0.1W, 1/10W; Part Number: ERA-3AEB682V; Height - Seated (Max): 0.022" (0.55mm); Supplier Part Number 1: P6.8KDBCT-ND; Supplier Device Package: 0603; ComponentLink1Description: Datasheet; ComponentLink2URL: https://www.digikey.com/en/products/detail/panasonic-electronic-components/ERA-3AEB682V/1465874; Features: Automotive AEC-Q200; ComponentLink1URL: https://industrial.panasonic.com/cdbs/www-data/pdf/RDM0000/AOA0000C307.pdf; Composition: Thin Film; Tolerance: ±0.1%; Supplier 1: DigiKey; Series: ERA-3A; Part Status: Active; ComponentLink2Description: DigiKey Link; Device Package: 0603 (1608 Metric); Packaging: TapeAndReel; Ratings: AEC-Q200; Minimum Order: 1; Package / Case: 0603 (1608 Metric); PartId: 5530; Lifecycle Status: Active; LastUpdated: 2023-01-02T20:30:24.413; Operating Temperature: -55°C ~ 155°C; Number Of Terminations: 2; Value: 6.8 kOhms; Size / Dimension: 0.063" L x 0.031" W (1.60mm x 0.80mm); Price: 0.04; Resistance: 6.8 kOhms
SW1C = CMP-10040-000026-1: SWITCH TACTILE SPST-NO 0.05A 50V; Contact Current Rating: 50mA; Max Voltage Rating (DC): 32V; Switch Travel: 0.3mm; Illumination Type: Illuminated; Power Rating: 1W; Operating Force: 3N; Switch Function: Off-Mom; Ratings: IP40; Actuator Length: 0.75mm; Mechanical Life: 100000Cycles; Throw Configuration: SPST; Min Operating Temperature: -40°C; Orientation: Right Angle; Radiation Hardening: No; Mount: Surface Mount; Max Current Rating: 50mA; Packaging: Tape and Reel; Width: 1.42mm; Depth: 4.6mm; Termination: Gull Wing; Contact Plating: Silver; Lead Free: Lead Free; Max Operating Temperature: 85°C; Length: 3.55mm; Current Rating: 50mA; Voltage Rating (DC): 32V; Package Quantity: 1; Contact Material: Silver
U1C = MAX4932ETD+T: No Description Available; Mfr_Name: Analog Devices Inc; RefDes: RefDes; Type: Type; Supplier 1: Mouser; Supplier Part Number 1: 700-MAX4932ETDT
U2C = CMP-0859-00701-3: Single Positive-Edge-Triggered D-Type Flip-Flop With Clear and Preset, DCU0008A, LARGE T&R; Manufacturer: Texas Instruments; Rating: Catalog; Technology Family: LVC; Output Type: CMOS; VCC(Max)(V): 5.5; ICC @ Nom Voltage(Max)(mA): 0.01; Output Drive (IOL/IOH)(Max)(mA): 32/-32; 3-State Output: No; VCC(Min)(V): 1.65; Input Type: CMOS/TTL; Logic: True; Bits(#): 1; Voltage(Nom)(V): 1.8,2.5,3.3,5; tpd @ Nom Voltage(Max)(ns): 13.4,7.1,5.9,4.1; F @ Nom Voltage(Max)(Mhz): 150; PackageReference: DCU0008A; Sub-Family: D-Type Flip-Flop; Schmitt Trigger: No; DatasheetVersion: SCES794E; Generic Part Number: SN74LVC1G74; Operating Temperature Range(C): -40 to 125

## Nets that join several sheets
DAC_VDD: U_BLE (C3B_U_BLE#1.2 U1B_U_BLE#1.9), MUX (C4C.1 R5C.2), U_BLE (C3B_U_BLE#2.2 U1B_U_BLE#2.9)
GND: Power (16 pins), U_BLE (14 pins), MUX (5 pins), U_BLE (14 pins)
GNDA: Power (R3A.2), U_BLE (C3B_U_BLE#1.1 C4B_U_BLE#1.1 U1B_U_BLE#1.11), MUX (C4C.2 C5C.2 J1C.1), U_BLE (C3B_U_BLE#2.1 C4B_U_BLE#2.1 U1B_U_BLE#2.11)
VCC: Power (R1A.2), MUX (6 pins)
BTN: U_BLE (U1B_U_BLE#1.17), MUX (C3C.2 C5C.1 R4C.1 R5C.1), U_BLE (U1B_U_BLE#2.17)
DACL: U_BLE (U1B_U_BLE#1.8), MUX (U1C.5)
DACL: MUX (U1C.12), U_BLE (U1B_U_BLE#2.8)
DACR: U_BLE (U1B_U_BLE#1.7), MUX (U1C.11)
DACR: MUX (U1C.4), U_BLE (U1B_U_BLE#2.7)
MIC: U_BLE (U1B_U_BLE#1.6), MUX (C3C.1), U_BLE (U1B_U_BLE#2.6)